# EAGLE design Rapide328smd (EAGLE 6.3)
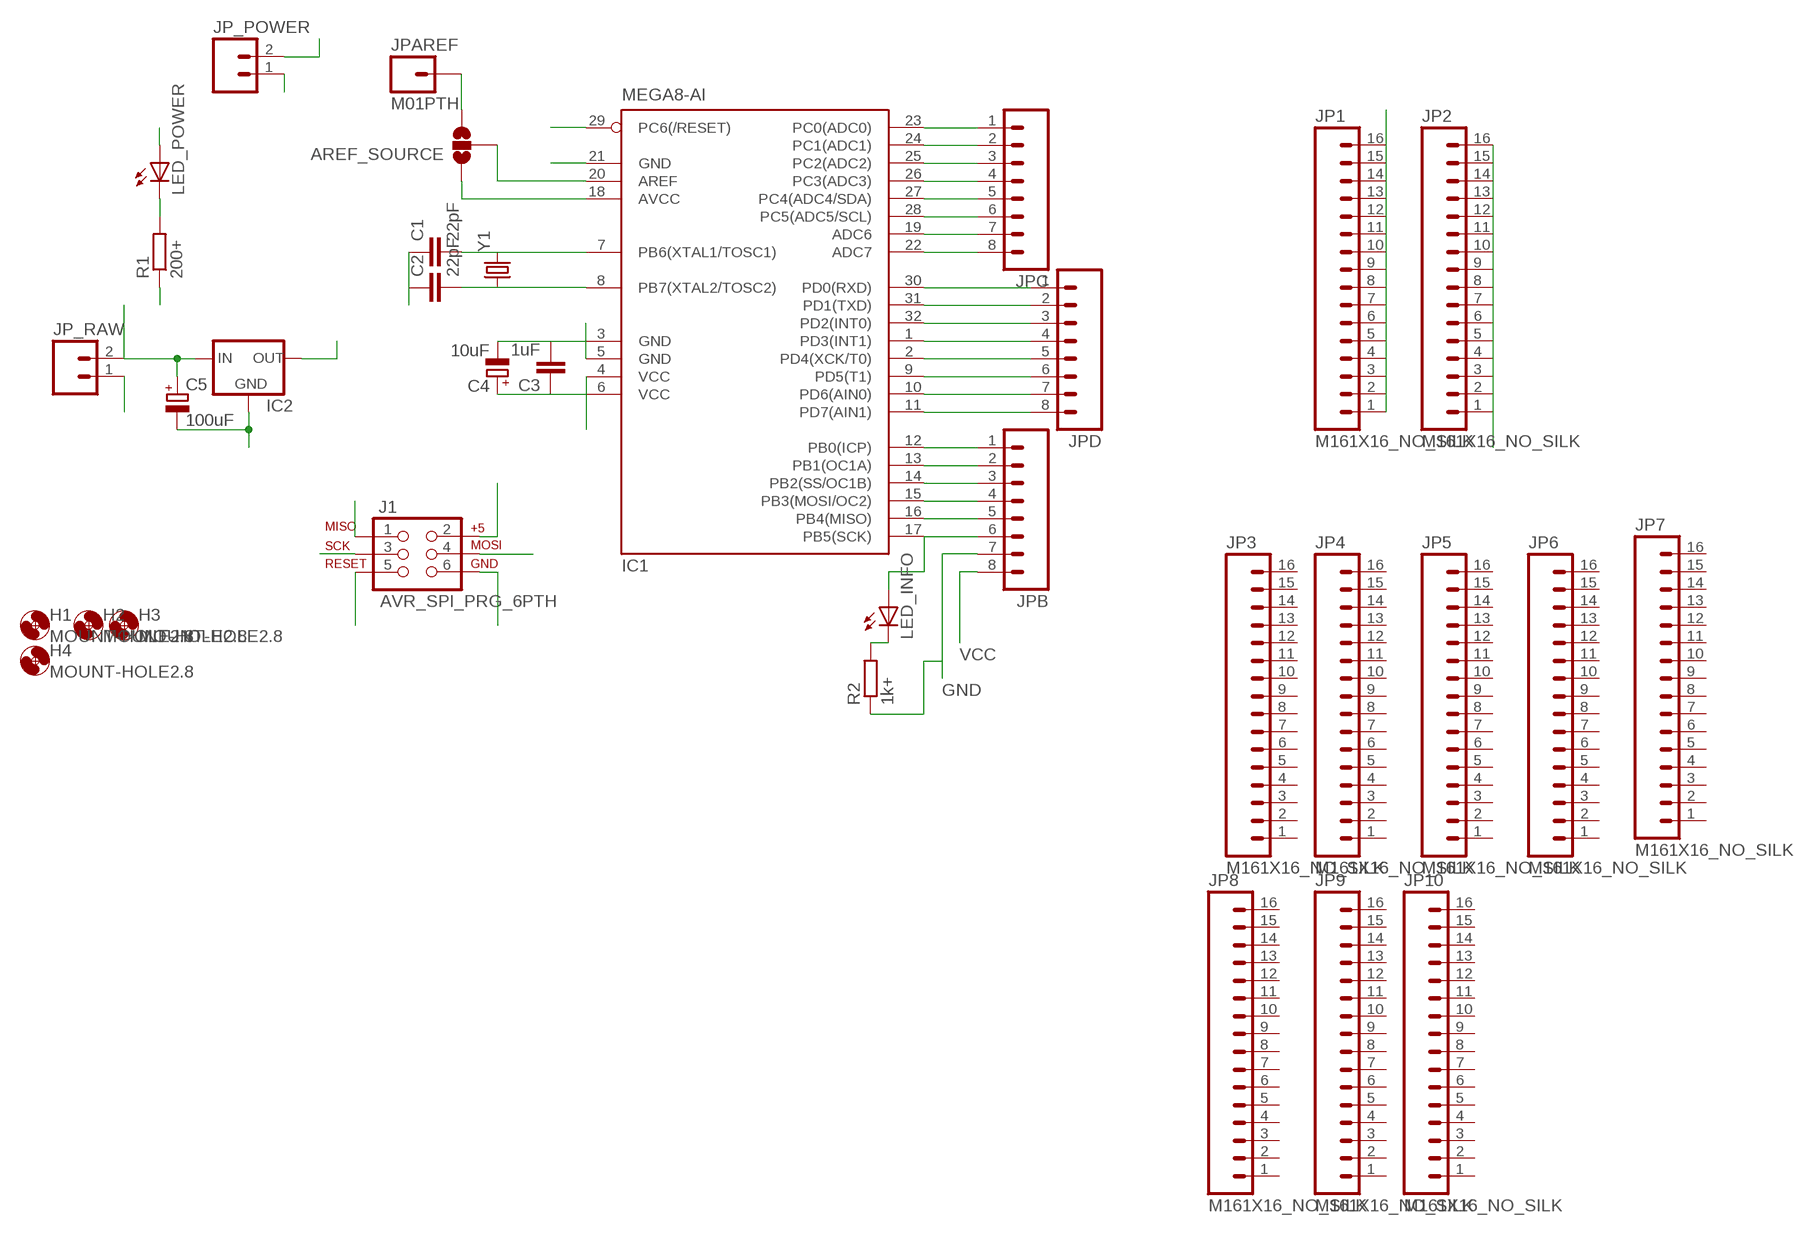
[diagram p0: schematic, sheet 1]

## Parts
AREF_SOURCE  SOLDERJUMPER_2WAYPASTE1&2  [SJ_3_PASTE1&2]
C1  22pF  C-EU025-024X044  [C025-024X044]
C2  22pF  C-EU025-024X044  [C025-024X044]
C3  1uF  C-EU025-024X044  [C025-024X044]
C4  10uF  CPOL-EUE2-5  [E2-5]
C5  100uF  CPOL-EUE2-5  [E2-5]
H1  MOUNT-HOLE2.8  [2,8]
H2  MOUNT-HOLE2.8  [2,8]
H3  MOUNT-HOLE2.8  [2,8]
H4  MOUNT-HOLE2.8  [2,8]
IC1  MEGA8-AI  [TQFP32-08]
IC2  V_REG_78XXSINK  [TO220-IGO]
J1  AVR_SPI_PRG_6PTH  [2X3]
JP1  M161X16_NO_SILK  [1X16_NO_SILK]
JP2  M161X16_NO_SILK  [1X16_NO_SILK]
JP3  M161X16_NO_SILK  [1X16_NO_SILK]
JP4  M161X16_NO_SILK  [1X16_NO_SILK]
JP5  M161X16_NO_SILK  [1X16_NO_SILK]
JP6  M161X16_NO_SILK  [1X16_NO_SILK]
JP7  M161X16_NO_SILK  [1X16_NO_SILK]
JP8  M161X16_NO_SILK  [1X16_NO_SILK]
JP9  M161X16_NO_SILK  [1X16_NO_SILK]
JP10  M161X16_NO_SILK  [1X16_NO_SILK]
JP_POWER  M02PTH3  [1X02_LONGPADS]
JP_RAW  M02PTH3  [1X02_LONGPADS]
JPAREF  M01PTH  [1X01]
JPB  M081X08  [1X08]
JPC  M081X08  [1X08]
JPD  M081X08  [1X08]
LED_INFO  LEDKA-3528ASYC  [KA-3528ASYC]
LED_POWER  LEDKA-3528ASYC  [KA-3528ASYC]
R1  200+  R-EU_0204/7  [0204/7]
R2  1k+  R-EU_0204/5  [0204/5]
Y1  CRYSTALHC49UV  [HC49U-V]

## Nets
GND: C1.1 C2.1 C3.2 C4.- C5.- IC1.3(GND) IC1.5(GND) IC1.21(GND) IC2.GND J1.6 JP2.1 JP2.2 JP2.3 JP2.4 JP2.5 JP2.6 JP2.7 JP2.8 JP2.9 JP2.10 JP2.11 JP2.12 JP2.13 JP2.14 JP2.15 JP2.16 JP_POWER.1 JP_RAW.1 JPB.7 R1.1 R2.1
MISO: IC1.16(PB4(MISO)) J1.1 JPB.5
MOSI: IC1.15(PB3(MOSI/OC2)) J1.4 JPB.4
N$1: C1.2 IC1.7(PB6(XTAL1/TOSC1)) Y1.2
N$3: LED_INFO.C R2.2
N$7: IC1.25(PC2(ADC2)) JPC.3
N$9: IC1.24(PC1(ADC1)) JPC.2
N$11: IC1.23(PC0(ADC0)) JPC.1
N$12: IC1.22(ADC7) JPC.8
N$13: IC1.12(PB0(ICP)) JPB.1
N$14: IC1.19(ADC6) JPC.7
N$15: IC1.28(PC5(ADC5/SCL)) JPC.6
N$16: IC1.27(PC4(ADC4/SDA)) JPC.5
N$17: IC1.26(PC3(ADC3)) JPC.4
N$18: AREF_SOURCE.2 IC1.20(AREF)
N$26: C2.2 IC1.8(PB7(XTAL2/TOSC2)) Y1.1
N$27: AREF_SOURCE.3 JPAREF.1
N$28: IC1.11(PD7(AIN1)) JPD.8
N$30: LED_POWER.C R1.2
N$32: IC1.10(PD6(AIN0)) JPD.7
N$34: IC1.13(PB1(OC1A)) JPB.2
N$36: IC1.9(PD5(T1)) JPD.6
N$38: IC1.14(PB2(SS/OC1B)) JPB.3
N$39: IC1.2(PD4(XCK/T0)) JPD.5
N$40: IC1.1(PD3(INT1)) JPD.4
N$41: IC1.32(PD2(INT0)) JPD.3
N$43: IC1.31(PD1(TXD)) JPD.2
N$44: IC1.30(PD0(RXD)) JPD.1
RESET: IC1.29(PC6(/RESET)) J1.5
SCK: IC1.17(PB5(SCK)) J1.3 JPB.6 LED_INFO.A
VCC: AREF_SOURCE.1 C3.1 C4.+ IC1.4(VCC) IC1.6(VCC) IC1.18(AVCC) IC2.OUT J1.2 JP1.1 JP1.2 JP1.3 JP1.4 JP1.5 JP1.6 JP1.7 JP1.8 JP1.9 JP1.10 JP1.11 JP1.12 JP1.13 JP1.14 JP1.15 JP1.16 JP_POWER.2 JPB.8 LED_POWER.A
VRAW: C5.+ IC2.IN JP_RAW.2
Unconnected: JP3.1 JP3.2 JP3.3 JP3.4 JP3.5 JP3.6 JP3.7 JP3.8 JP3.9 JP3.10 JP3.11 JP3.12 JP3.13 JP3.14 JP3.15 JP3.16 JP4.1 JP4.2 JP4.3 JP4.4 JP4.5 JP4.6 JP4.7 JP4.8 JP4.9 JP4.10 JP4.11 JP4.12 JP4.13 JP4.14 JP4.15 JP4.16 JP5.1 JP5.2 JP5.3 JP5.4 JP5.5 JP5.6 JP5.7 JP5.8 JP5.9 JP5.10 JP5.11 JP5.12 JP5.13 JP5.14 JP5.15 JP5.16 JP6.1 JP6.2 JP6.3 JP6.4 JP6.5 JP6.6 JP6.7 JP6.8 JP6.9 JP6.10 JP6.11 JP6.12 JP6.13 JP6.14 JP6.15 JP6.16 JP7.1 JP7.2 JP7.3 JP7.4 JP7.5 JP7.6 JP7.7 JP7.8 JP7.9 JP7.10 JP7.11 JP7.12 JP7.13 JP7.14 JP7.15 JP7.16 JP8.1 JP8.2 JP8.3 JP8.4 JP8.5 JP8.6 JP8.7 JP8.8 JP8.9 JP8.10 JP8.11 JP8.12 JP8.13 JP8.14 JP8.15 JP8.16 JP9.1 JP9.2 JP9.3 JP9.4 JP9.5 JP9.6 JP9.7 JP9.8 JP9.9 JP9.10 JP9.11 JP9.12 JP9.13 JP9.14 JP9.15 JP9.16 JP10.1 JP10.2 JP10.3 JP10.4 JP10.5 JP10.6 JP10.7 JP10.8 JP10.9 JP10.10 JP10.11 JP10.12 JP10.13 JP10.14 JP10.15 JP10.16

## Library data of the parts
AREF_SOURCE = SparkFun-Passives:SOLDERJUMPER_2WAY: Solder Jumper 2 way solder jumper
C1-C3 = resistor:C-EU: CAPACITOR, European symbol
C4 C5 = resistor:CPOL-EU: POLARIZED CAPACITOR, European symbol
H1-H4 = holes:MOUNT-HOLE: MOUNTING HOLE with drill center marker
IC1 = atmel:MEGA8: MICROCONTROLLER 8 Kbytes FLASH, 1 kbytes SRAM, 512 bytes EEPROM, USART, 6-channel 10 bit ADC, 2-channel 8 bit ADC Pin compatible with Atmega48, ATMega88, ATMega168 Source: avr.lbr; MPN: ATMEGA8-16AU; OC_FARNELL: 9171371; OC_NEWARK: 73M8863
IC2 = SparkFun-PowerIC:V_REG_78XX: Voltage Regulator Standard 7805 5V regulator. IGO (Input Ground Output). Spark Fun Electronics SKU : COM-00107
J1 = SparkFun-Connectors:AVR_SPI_PRG_6: AVR ISP 6 Pin This is the reduced ISP connector for AVR programming. Common on Arduino. This footprint will take up less PCB space and can be used with a 10-pin to 6-pin adapter such as SKU: BOB-08508
JP1-JP10 = SparkFun-Connectors:M16: 1x16 .1" header
JP_POWER JP_RAW = SparkFun-Connectors:M02: Header 2 Standard 2-pin 0.1" header. Use with straight break away headers (SKU : PRT-00116), right angle break away headers (PRT-00553), swiss pins (PRT-00743), machine pins (PRT-00117), and female headers (PRT-00115). Molex polarized connector foot print use with SKU : PRT-08233 with associated crimp pins and housings.
JPAREF = SparkFun-Connectors:M01: Header 1 Standard 1-pin 0.1" header. Use with straight break away headers (SKU : PRT-00116), right angle break away headers (PRT-00553), swiss pins (PRT-00743), machine pins (PRT-00117), and female headers (PRT-00115).
JPB JPC JPD = SparkFun-Connectors:M08: Header 8 Standard 8-pin 0.1" header. Use with straight break away headers (SKU : PRT-00116), right angle break away headers (PRT-00553), swiss pins (PRT-00743), machine pins (PRT-00117), and female headers (PRT-00115).
LED_INFO LED_POWER = led:LED: LED OSRAM: - CHIPLED LG R971, LG N971, LY N971, LG Q971, LY Q971, LO R971, LY R971 LH N974, LH R974 LS Q976, LO Q976, LY Q976 LO Q996 - Hyper CHIPLED LW Q18S LB Q993, LB Q99A, LB R99A - SideLED LS A670, LO A670, LY A670, LG A670, LP A670 LB A673, LV A673, LT A673, LW A673 LH A674 LY A675 LS A676, LA A676, LO A676, LY A676, LW A676 LS A679, LY A679, LG A679 - Hyper Micro SIDELED® LS Y876, LA Y876, LO Y876, LY Y876 LT Y87S - SmartLED LW L88C, LW L88S LB L89C, LB L89S, LG L890 LS L89K, LO L89K, LY L89K LS L896, LA L896, LO L896, LY L896 - TOPLED LS T670, LO T670, LY T670, LG T670, LP T670 LSG T670, LSP T670, LSY T670, LOP T670, LYG T670 LG T671, LOG T671, LSG T671 LB T673, LV T673, LT T673, LW T673 LH T674 LS T676, LA T676, LO T676, LY T676, LB T676, LH T676, LSB T676, LW T676 LB T67C, LV T67C, LT T67C, LS T67K, LO T67K, LY T67K, LW E67C LS E67B, LA E67B, LO E67B, LY E67B, LB E67C, LV E67C, LT E67C LW T67C LS T679, LY T679, LG T679 LS T770, LO T770, LY T770, LG T770, LP T770 LB T773, LV T773, LT T773, LW T773 LH T774 LS E675, LA E675, LY E675, LS T675 LS T776, LA T776, LO T776, LY T776, LB T776 LHGB T686 LT T68C, LB T68C - Hyper Mini TOPLED® LB M676 - Mini TOPLED Santana® LG M470 LS M47K, LO M47K, LY M47K Source: http://www.osram.convergy.de LUXEON: - LUMILED® LXK2-PW12-R00, LXK2-PW12-S00, LXK2-PW14-U00, LXK2-PW14-V00 LXK2-PM12-R00, LXK2-PM12-S00, LXK2-PM14-U00 LXK2-PE12-Q00, LXK2-PE12-R00, LXK2-PE12-S00, LXK2-PE14-T00, LXK2-PE14-U00 LXK2-PB12-K00, LXK2-PB12-L00, LXK2-PB12-M00, LXK2-PB14-N00, LXK2-PB14-P00, LXK2-PB14-Q00 LXK2-PR12-L00, LXK2-PR12-M00, LXK2-PR14-Q00, LXK2-PR14-R00 LXK2-PD12-Q00, LXK2-PD12-R00, LXK2-PD12-S00 LXK2-PH12-R00, LXK2-PH12-S00 LXK2-PL12-P00, LXK2-PL12-Q00, LXK2-PL12-R00 Source: www.luxeon.com KINGBRIGHT: KA-3528ASYC Source: www.kingbright.com
R1 R2 = resistor:R-EU_: RESISTOR, European symbol
Y1 = SparkFun-FreqCtrl:CRYSTAL: Various standard crystals. Proven footprints. Spark Fun Electronics SKU : COM-00534

## Board
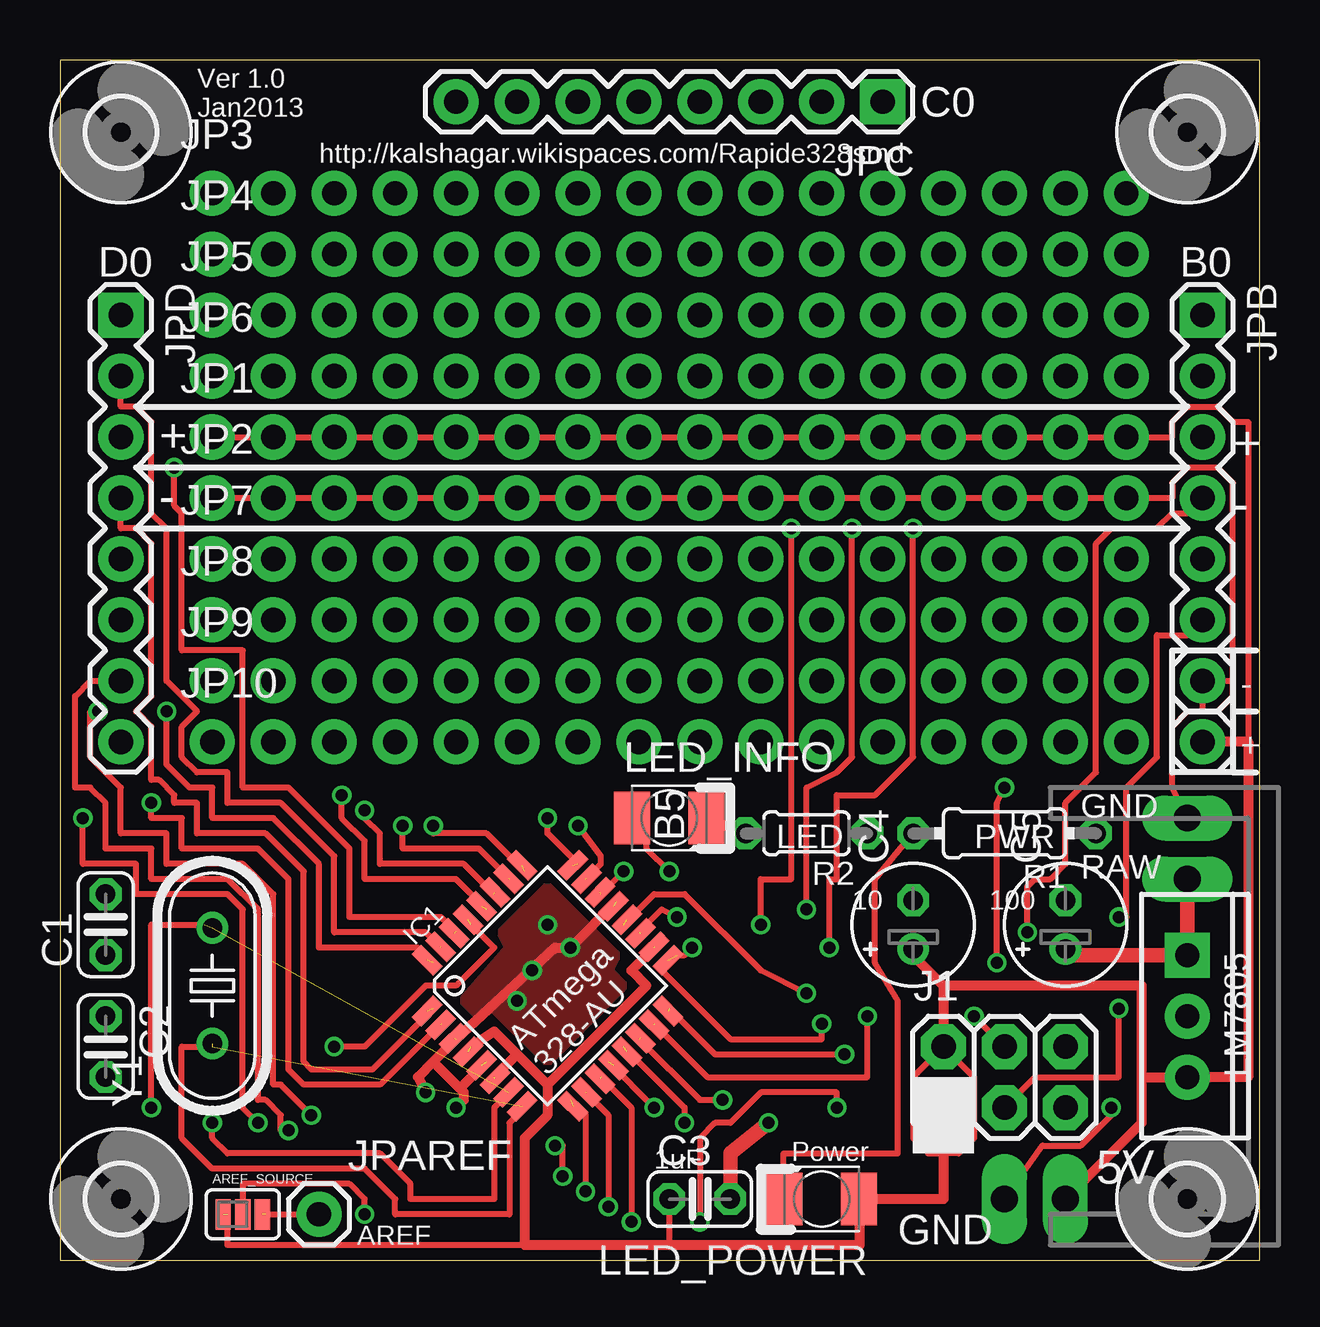
[diagram p1: board, top side]
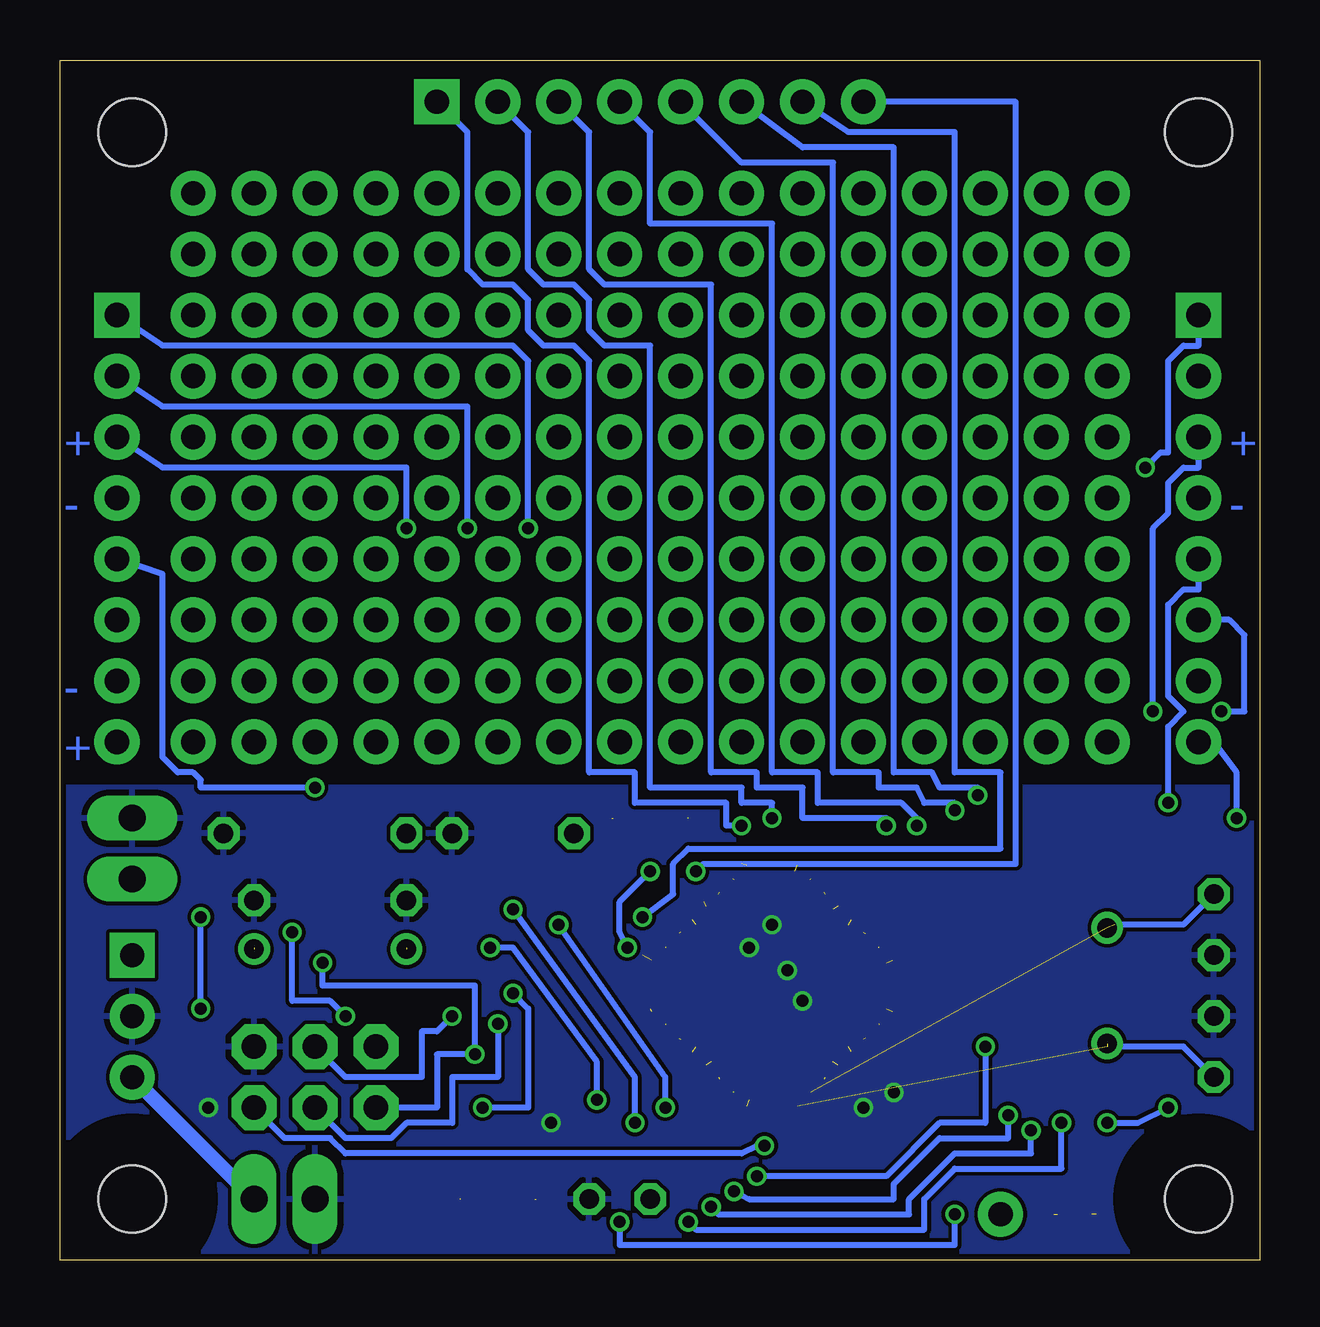
[diagram p2: board, bottom side, seen from below]

Size 50 x 50 mm. Coordinates in mm from the lower left corner, seen from the top.
Outline: 0,0 50,0 50,50 0,50 0,0
Copper layers (1*16): Top 0.035mm / dielectric 1.5mm / Bottom 0.035mm
Design rules "Fusion_eagle_rule_v1.1": minimum track width 6mil, minimum drill 12mil, track to track 6mil, track to pad 6mil, pad to pad 6mil, via to via 6mil, smd to smd 0mil, copper to edge 10mil, drill to drill 10mil, minimum pad ring 10mil, minimum via ring 6mil, stop-mask expansion 2mil, vias tented up to drill 100mil, thermal gap 10mil

### Footprints (pad centres in the part's own frame; a part is rotated, then mirrored left to right if it is on the bottom)
SJ_3_PASTE1&2 = smd 0.635 x 1.27: 1 -0.813,0; 2 0,0; 3 0.813,0
C025-024X044 = drill 0.813 octagon: 1 -1.27,0; 2 1.27,0
E2-5 = drill 0.813 pad 1.27: + -1.016,0 | drill 0.813 pad 1.27 octagon: - 1.016,0
2,8 = hole 2.8: 0,0
TQFP32-08 = smd 1.27 x 0.559: 1 -4.293,2.8; 2 -4.293,2; 3 -4.293,1.2; 4 -4.293,0.4; 5 -4.293,-0.4; 6 -4.293,-1.2; 7 -4.293,-2; 8 -4.293,-2.8; 17 4.293,-2.8; 18 4.293,-2; 19 4.293,-1.2; 20 4.293,-0.4; 21 4.293,0.4; 22 4.293,1.2; 23 4.293,2; 24 4.293,2.8 | smd 0.559 x 1.27: 9 -2.8,-4.293; 10 -2,-4.293; 11 -1.2,-4.293; 12 -0.4,-4.293; 13 0.4,-4.293; 14 1.2,-4.293; 15 2,-4.293; 16 2.8,-4.293; 25 2.8,4.293; 26 2,4.293; 27 1.2,4.293; 28 0.4,4.293; 29 -0.4,4.293; 30 -1.2,4.293; 31 -2,4.293; 32 -2.8,4.293
TO220-IGO = drill 1 pad 1.88: GND 0,0; OUT 2.54,0 | drill 1 pad 1.88 square: IN -2.54,0
2X3 = drill 1.016 pad 1.88 octagon: 1 0,0; 2 0,2.54; 3 2.54,0; 4 2.54,2.54; 5 5.08,0; 6 5.08,2.54
1X16_NO_SILK = drill 1.016 pad 1.88: 1 0,0; 2 2.54,0; 3 5.08,0; 4 7.62,0; 5 10.16,0; 6 12.7,0; 7 15.24,0; 8 17.78,0; 9 20.32,0; 10 22.86,0; 11 25.4,0; 12 27.94,0; 13 30.48,0; 14 33.02,0; 15 35.56,0; 16 38.1,0
1X02_LONGPADS = drill 1.118 pad 1.88 long: 1 0,0; 2 2.54,0
1X01 = drill 1.016 pad 1.88: 1 0,0
1X08 = drill 1.016 pad 1.88 square: 1 0,0 | drill 1.016 pad 1.88: 2 2.54,0; 3 5.08,0; 4 7.62,0; 5 10.16,0; 6 12.7,0; 7 15.24,0; 8 17.78,0
KA-3528ASYC = smd 1.5 x 2.2: A -1.55,0; C 1.55,0
0204/7 = drill 0.813 octagon: 1 -3.81,0; 2 3.81,0
0204/5 = drill 0.813 octagon: 1 -2.54,0; 2 2.54,0
HC49U-V = drill 0.813: 1 -2.413,0; 2 2.413,0

### Placement (x,y rotation side)
AREF_SOURCE  7.62,1.91 0 top
C1  1.91,13.97 90 top
C2  1.91,8.89 270 top
C3  26.67,2.54 0 top
C4  35.56,13.97 90 top
C5  41.91,13.97 90 top
H1  2.54,46.99 0 top
H2  46.99,46.99 0 top
H3  46.99,2.54 0 top
H4  2.54,2.54 0 top
IC1  20.32,11.43 45 top
IC2  46.99,10.16 270 top
J1  36.83,6.35 0 top
JP1  6.35,34.29 0 top
JP2  6.35,31.75 0 top
JP3  6.35,44.45 0 top
JP4  6.35,41.91 0 top
JP5  6.35,39.37 0 top
JP6  6.35,36.83 0 top
JP7  6.35,29.21 0 top
JP8  6.35,26.67 0 top
JP9  6.35,24.13 0 top
JP10  6.35,21.59 0 top
JP_POWER  39.37,2.54 0 top
JP_RAW  46.99,18.41 270 top
JPAREF  10.79,1.91 0 top
JPB  47.62,39.37 270 top
JPC  34.29,48.26 180 top
JPD  2.54,39.37 270 top
LED_INFO  25.4,18.41 0 top
LED_POWER  31.75,2.54 180 top
R1  39.37,17.78 180 top
R2  31.11,17.78 180 top
Y1  6.35,11.43 90 top

### Tracks (layer width: path | path; a pad name or v marks a point on that pad's centre or on a via)
GND  (via drill 0.5)  (3 unrouted)
  Top 0.254: JP_RAW.1 46.35,19.68 46.35,22.23 46.99,22.86 47.62,22.86 | 47.62,22.86 48.26,22.86 48.9,23.5 48.9,24.13 | 48.9,24.13 48.9,32.38 48.26,33.02 46.99,33.02 46.35,32.38 46.35,31.75 JP2.16 JP2.15 JP2.14 JP2.13 JP2.12 JP2.11 JP2.10 JP2.9 JP2.8 JP2.7 JP2.6 JP2.5 JP2.4 JP2.3 JP2.2 JP2.1 | 16.83,7.3 16.83,6.99 | JP_POWER.1 40.96,4.76 42.55,4.76 43.81,6.03 v43.81,6.35 | 47.62,22.86 JPB.7 48.9,24.13 | 23.18,14.92 23.5,14.92
  Top 0.406: 15.56,8.26 16.51,9.21 20.64,13.02 v21.27,13.02 23.18,14.92 | 15.56,8.26 16.83,6.99 16.83,6.67 v16.51,6.35 | 16.83,7.3 17.78,8.26 | 15.56,8.26 14.92,7.62 v15.24,6.99
  Top 0.61: C3.2 27.94,4.45 v29.53,5.71
  other vias: 20.32,13.97 19.68,12.06 19.05,10.79
  pour Bottom: -1.91,19.68 50.8,19.68 50.8,-0.64 -1.91,-0.64
  pour Top: 18.41,13.65 20.32,15.56 23.18,12.7 22.86,12.06 23.5,11.43 20.32,8.26 18.1,10.48 17.78,10.48 17.46,10.16 16.83,10.79 18.73,13.02
MISO  (via drill 0.5)  (1 unrouted)
  Top 0.254: 25.4,10.48 27.3,8.57 v32.7,8.57 | v39.05,12.38 39.05,19.05 v39.37,19.68
  Bottom 0.254: J1.1 34.29,6.35 34.29,8.57 v32.7,8.57 32.7,11.43 39.05,11.43 v39.05,12.38 | v39.37,19.68 44.13,19.68 44.13,20 44.45,20.32 45.09,20.32 45.72,20.95 45.72,28.57 JPB.5
MOSI  (via drill 0.5)  (1 unrouted)
  Top 0.254: 24.77,9.84 26.99,7.62 33.66,7.62 v33.66,10.16 | J1.4 v38.1,10.16 | v40.32,13.65 40.32,15.56 40.64,15.88 41.27,15.88 41.91,16.51 41.91,19.05 43.18,20.32 43.18,29.84 43.81,30.48 45.72,30.48 46.35,31.11 46.99,31.11 JPB.4
  Bottom 0.254: v33.66,10.16 34.29,9.53 34.92,9.53 34.92,7.62 38.1,7.62 J1.4 | v38.1,10.16 38.73,10.79 40.32,10.79 v40.32,13.65
N$1  (2 unrouted)
  Bottom 0.254: C1.2 3.17,13.97 6.03,13.97
N$2
  Top 0.254: 19.37,6.35 18.73,5.71 18.73,1.91 13.97,1.91 13.97,2.54 12.7,3.81 6.35,3.81 5.08,5.08 5.08,8.89 6.35,8.89
N$3  (1 unrouted)
  Top 0.406: 26.99,18.41 R2.2
N$7  (via drill 0.5)  (1 unrouted)
  Top 0.254: 19.37,16.19 17.78,17.78 15.56,17.78 v15.56,18.1
  Bottom 0.254: v15.56,18.1 15.56,18.41 19.05,18.41 19.05,19.68 20.95,19.68 20.95,20.32 22.86,20.32 22.86,40.64 27.3,40.64 27.94,41.27 27.94,46.99 JPC.3
N$9  (via drill 0.5)  (1 unrouted)
  Top 0.254: 21.27,16.19 21.59,16.51 20.32,17.78 v20.32,18.41
  Bottom 0.254: v20.32,18.41 20.32,19.05 21.59,19.05 21.59,19.68 25.4,19.68 25.4,38.1 27.3,38.1 27.94,38.73 27.94,40.01 28.57,40.64 29.84,40.64 30.48,41.27 30.48,46.99 JPC.2
N$11  (via drill 0.5)  (1 unrouted)
  Top 0.254: 21.91,15.88 22.54,16.51 22.54,16.83 v21.59,18.1
  Bottom 0.254: v21.59,18.1 22.23,18.1 22.23,19.05 26.04,19.05 26.04,20.32 27.94,20.32 27.94,37.47 28.57,38.1 29.84,38.1 30.48,38.73 30.48,40.01 31.11,40.64 32.38,40.64 33.02,41.27 33.02,46.99 JPC.1
N$12  (via drill 0.5)  (1 unrouted)
  Top 0.254: 22.54,15.24 v23.5,16.19
  Bottom 0.254: v23.5,16.19 23.18,16.51 10.16,16.51 10.16,48.26 JPC.8
N$13  (via drill 0.5)  (1 unrouted)
  Top 0.254: 22.86,8.26 v24.77,6.35 | v29.21,13.97 29.21,15.88 30.48,15.88 v30.48,30.48
  Bottom 0.254: v24.77,6.35 24.77,7.62 v29.21,13.97 | v30.48,30.48 30.48,37.47 31.11,38.1 45.72,38.1 JPB.1
N$14  (via drill 0.5)  (1 unrouted)
  Top 0.254: 24.13,13.65 25.08,14.61 v25.72,14.29
  Bottom 0.254: v25.72,14.29 24.45,15.24 24.45,16.51 23.81,17.14 10.79,17.14 10.79,20.32 12.7,20.32 12.7,46.99 17.14,46.99 JPC.7
N$15  (via drill 0.5)  (1 unrouted)
  Top 0.254: 17.78,14.61 16.51,15.88 12.7,15.88 12.7,17.46 11.75,18.41 v11.75,19.37
  Bottom 0.254: v11.75,19.37 11.75,19.68 13.34,19.68 13.65,20.32 15.24,20.32 15.24,46.35 19.05,46.35 JPC.6
N$16  (via drill 0.5)  (1 unrouted)
  Top 0.254: 18.1,15.24 16.83,16.51 13.34,16.51 13.34,17.78 12.7,18.41 v12.7,18.73
  Bottom 0.254: v12.7,18.73 12.7,19.05 13.97,19.05 14.29,19.68 15.88,19.68 15.88,20.32 17.78,20.32 17.78,45.72 21.59,45.72 JPC.5
N$17  (via drill 0.5)  (1 unrouted)
  Top 0.254: 18.73,15.88 17.46,17.14 14.29,17.14 v14.29,18.1
  Bottom 0.254: v14.29,18.1 14.29,18.41 14.92,19.05 18.41,19.05 18.41,20.32 20.32,20.32 20.32,43.18 25.4,43.18 25.4,46.99 JPC.4
N$18  (via drill 0.5)  (1 unrouted)
  Top 0.254: 23.5,13.97 24.77,15.24 26.04,15.24 29.21,12.06 v31.11,11.11 | v32.38,6.35 32.38,6.99 29.21,6.99 27.94,5.71 27.3,5.71 26.67,5.08 v26.67,1.59 | v12.7,1.91 12.7,2.54 12.06,3.17 7.62,3.17 AREF_SOURCE.2
  Bottom 0.254: v31.11,11.11 30.48,10.48 30.48,6.35 v32.38,6.35 | v26.67,1.59 26.67,0.64 12.7,0.64 v12.7,1.91
N$25  (via drill 0.5)
  Top 0.254: 18.73,6.99 18.1,6.35 18.1,2.54 14.61,2.54 14.61,3.17 13.34,4.45 6.99,4.45 6.35,5.08 v6.35,5.71 | v3.81,6.35 3.81,13.97 6.35,13.97
  Bottom 0.254: v6.35,5.71 5.08,5.71 v3.81,6.35
N$26  (2 unrouted)
  Bottom 0.254: C2.2 3.17,8.89 6.35,8.89
N$27  (1 unrouted)
  Top 0.254: 8.57,1.91 JPAREF.1
N$28  (via drill 0.5)  (1 unrouted)
  Top 0.254: 22.54,7.62 23.81,6.35 v23.81,1.59 | v8.26,5.71 7.62,6.35 7.62,14.61 6.99,15.24 3.17,15.24 3.17,16.51 0.95,16.51 v0.95,18.41
  Bottom 0.254: v23.81,1.59 23.5,1.27 13.97,1.27 13.97,2.54 12.7,3.81 8.26,3.81 v8.26,5.71 | v0.95,18.41 0.95,20.32 1.91,21.59 JPD.8
N$30  (1 unrouted)
  Top 0.254: 30.16,2.54 30.16,4.45 34.92,4.45 34.92,10.79 33.97,12.38 33.97,15.88 R1.2
N$32  (via drill 0.5)  (1 unrouted)
  Top 0.254: 21.91,6.99 22.86,6.03 v22.86,2.22 | v9.53,5.4 9.21,5.4 9.21,6.03 8.57,6.67 8.26,6.67 8.26,14.61 6.99,15.88 3.81,15.88 3.81,17.14 1.91,17.14 1.91,19.05 1.27,19.68 0.64,19.68 0.64,23.5 1.27,24.13 JPD.7
  Bottom 0.254: v22.86,2.22 22.54,1.91 14.61,1.91 14.61,2.54 12.7,4.45 9.53,4.45 v9.53,5.4
N$34  (via drill 0.5)  (1 unrouted)
  Top 0.254: 23.5,8.89 26.04,6.35 v26.04,5.71 | v31.11,14.61 31.11,19.68 32.38,20.32 33.02,20.95 v33.02,30.48
  Bottom 0.254: v26.04,5.71 26.04,7.62 v31.11,14.61 | v33.02,30.48 33.02,35.56 45.72,35.56 JPB.2
N$36  (via drill 0.5)  (1 unrouted)
  Top 0.254: 21.27,6.67 21.91,6.03 v21.91,2.86 | v10.48,6.03 9.21,7.3 8.89,7.3 8.89,15.24 7.62,16.51 4.45,16.51 4.45,17.78 2.54,17.78 2.54,19.68 1.27,20.95 1.27,22.86 v1.59,22.86
  Bottom 0.254: v21.91,2.86 21.27,2.54 15.24,2.54 15.24,3.17 13.34,5.08 10.48,5.08 v10.48,6.03 | v1.59,22.86 0.64,22.86 0.64,26.04 1.27,26.67 JPD.6
N$38  (via drill 0.5)  (1 unrouted)
  Top 0.254: 24.13,9.21 26.67,6.67 v27.62,6.67 | v32.07,13.02 32.07,15.88 32.38,15.88 32.38,19.37 33.97,19.37 35.56,20.95 v35.56,30.48
  Bottom 0.254: v27.62,6.67 27.62,8.26 31.11,13.02 v32.07,13.02 | v35.56,30.48 35.56,33.02 45.72,33.02 JPB.3
N$39  (via drill 0.5)  (1 unrouted)
  Top 0.254: 15.88,9.84 13.34,7.3 10.16,7.3 9.53,7.94 9.53,15.88 8.26,17.14 5.08,17.14 5.08,18.41 3.81,18.41 v3.81,19.05
  Bottom 0.254: v3.81,19.05 3.81,22.23 3.17,22.86 3.81,23.5 3.81,27.3 3.17,27.94 2.54,27.94 JPD.5
N$40  (1 unrouted)
  Top 0.254: 15.56,10.48 13.02,7.94 10.48,7.94 10.16,8.26 10.16,16.19 8.57,17.78 5.71,17.78 5.71,19.05 4.76,19.05 4.76,19.37 4.13,20 3.81,20 3.81,22.23 3.17,22.86 3.81,23.5 3.81,29.84 3.17,30.48 2.54,30.48 JPD.4
N$41  (via drill 0.5)  (1 unrouted)
  Top 0.254: 15.56,12.38 14.92,13.02 10.79,13.02 10.79,16.51 8.89,18.41 6.35,18.41 6.35,19.68 5.4,19.68 4.45,20.64 v4.45,22.86
  Bottom 0.254: v4.45,22.86 4.45,30.48 3.81,31.11 3.81,32.38 3.17,33.02 2.54,33.02 JPD.3
N$43  (1 unrouted)
  Top 0.254: 15.88,13.02 15.24,13.65 11.43,13.65 11.43,16.83 9.21,19.05 6.99,19.05 6.99,20.32 5.71,20.32 5.08,20.95 5.08,22.23 5.71,22.86 4.45,24.13 4.45,30.48 3.81,31.11 3.81,34.92 3.17,35.56 2.54,35.56 JPD.2
N$44  (via drill 0.5)  (1 unrouted)
  Top 0.254: 16.51,13.65 15.88,14.29 12.06,14.29 12.06,17.14 9.53,19.68 7.62,19.68 7.62,25.4 5.08,25.4 5.08,31.11 4.76,31.43 v4.76,33.02
  Bottom 0.254: v4.76,33.02 4.13,33.66 3.81,33.66 3.81,37.47 3.17,38.1 2.54,38.1 JPD.1
RESET  (via drill 0.5)  (1 unrouted)
  Top 0.254: v20.95,3.49 20.95,4.76 v20.64,4.76 | 17.14,13.97 18.1,13.02 16.51,11.43 15.24,11.43 12.7,8.89 v11.43,8.89
  Bottom 0.254: v11.43,8.89 11.43,5.71 13.34,5.71 15.56,3.49 v20.95,3.49 | v20.64,4.76 20.95,4.76 21.59,4.45 38.1,4.45 38.73,5.08 40.64,5.08 J1.5
SCK  (via drill 0.5)  (2 unrouted)
  Top 0.254: v31.75,9.84 31.75,9.21 27.94,9.21 25.08,12.06 25.72,12.7 26.04,12.7 v26.35,13.02 | J1.3 40.64,7.62 44.13,7.62 v44.13,10.48 | v44.13,14.29 44.45,14.29 44.45,19.68 45.72,20.95 45.72,26.04 46.99,26.04 JPB.6 | v25.4,16.19 24.45,17.14 24.45,18.41 23.81,18.41
  Bottom 0.254: v31.75,9.84 31.75,7.62 33.66,7.62 33.66,5.71 35.56,5.71 36.2,5.08 38.1,5.08 J1.3 | v44.13,10.48 v44.13,14.29 | v26.35,13.02 26.67,13.65 26.67,14.92 v25.4,16.19
VCC  (6 unrouted)
  Top 0.254: JP1.1 JP1.2 JP1.3 JP1.4 JP1.5 JP1.6 JP1.7 JP1.8 JP1.9 JP1.10 JP1.11 JP1.12 JP1.13 JP1.14 JP1.15 JP1.16 46.35,34.29 46.35,34.92 46.99,35.56 48.26,35.56 48.9,34.92 49.53,34.92 49.53,21.59 | 25.4,0.64 C3.1 | 19.37,0.64 6.99,0.64 6.99,1.91 | 33.34,2.54 33.34,2.22 33.02,2.54 | J1.2 38.1,7.62 38.1,5.08 37.47,4.45 36.83,4.45 36.2,4.45 35.56,5.08 35.56,7.62 J1.2
  Top 0.406: JP_POWER.2 45.09,5.71 45.09,7.62 | 45.09,7.62 45.09,11.43 36.83,11.43 | 36.83,11.43 J1.2 | 36.83,11.43 35.56,12.7 35.56,13.02 | 45.09,7.62 IC2.OUT 49.53,7.62 49.53,21.59 JPB.8 | 36.83,4.45 36.83,2.54 33.02,2.54 | 24.77,13.02 23.81,12.06 24.45,11.43 20.32,7.3 | 17.14,8.89 18.1,9.53 19.05,8.57 | 19.05,8.57 18.1,7.62 | 19.05,8.57 20.32,7.3 | 20.32,7.3 20.32,6.03 19.37,5.08 19.37,0.64 25.4,0.64 33.34,0.64 33.34,2.22
  Bottom 0.61: JP_POWER.2 IC2.OUT
VRAW  (1 unrouted)
  Top 0.61: JP_RAW.2 IC2.IN 42.23,12.7 41.91,13.02

### Text on the board
Bottom: + | + | - | - | - | +
_tNames: Ver 1.0 / Jan2013 | C0 | http://kalshagar.wikispaces.com/Rapide328smd | D0 | B0 | + | + | - | - | - | + | GND | B5 | LED | PWR | RAW | 10 | 100 | ATmega / 328-AU | LM7805 | 1uF | Power | 5V | AREF | GND